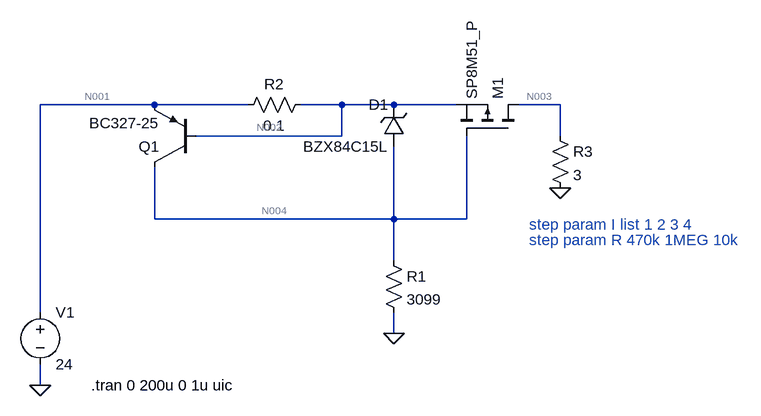
[diagram p0: schematic current_limiter.asc]
current_limiter.asc, the LTspice schematic file:
Version 4
SHEET 1 932 680
WIRE 16 112 -160 112
WIRE 160 112 16 112
WIRE 304 112 240 112
WIRE 384 112 304 112
WIRE 480 112 384 112
WIRE 640 112 576 112
WIRE 304 160 304 112
WIRE 304 160 80 160
WIRE 640 160 640 112
WIRE 16 288 16 208
WIRE 384 288 384 176
WIRE 384 288 16 288
WIRE 496 288 496 160
WIRE 496 288 384 288
WIRE 384 352 384 288
WIRE -160 432 -160 112
WIRE 384 464 384 432
WIRE -160 544 -160 512
FLAG 384 464 0
FLAG -160 544 0
FLAG 640 240 0
SYMBOL pnp 80 208 R180
SYMATTR InstName Q1
SYMATTR Value BC327-25
SYMBOL zener 400 176 R180
WINDOW 0 24 64 Left 2
WINDOW 3 24 0 Left 2
SYMATTR InstName D1
SYMATTR Value BZX84C15L
SYMATTR Description Diode
SYMATTR Type diode
SYMBOL res 368 336 R0
SYMATTR InstName R1
SYMATTR Value 3099
SYMBOL res 256 96 R90
WINDOW 0 0 56 VBottom 2
WINDOW 3 32 56 VTop 2
SYMATTR InstName R2
SYMATTR Value 0.1
SYMBOL pmos 576 160 M270
SYMATTR InstName M1
SYMATTR Value SP8M51_P
SYMBOL voltage -160 416 R0
SYMATTR InstName V1
SYMATTR Value 24
SYMBOL res 624 144 R0
SYMATTR InstName R3
SYMATTR Value 3
TEXT -82 544 Left 2 !.tran 0 200u 0 1u uic
TEXT 592 296 Left 2 ;step param I list 1 2 3 4
TEXT 592 320 Left 2 ;step param R 470k 1MEG 10k

The netlist it stands for:
* current_limiter.asc
Q1 N004 N002 N001 0 BC327-25
D1 N004 N002 BZX84C15L
R1 N004 0 3099
R2 N002 N001 0.1
M1 N003 N004 N002 N002 SP8M51_P
V1 N001 0 24
R3 N003 0 3
.model D D
.lib standard.dio
.model NPN NPN
.model PNP PNP
.lib standard.bjt
.model NMOS NMOS
.model PMOS PMOS
.lib standard.mos
.tran 0 200u 0 1u uic
* step param I list 1 2 3 4
* step param R 470k 1MEG 10k
.backanno
.end

* Results of the author's LTspice run, read from the files saved beside the schematic
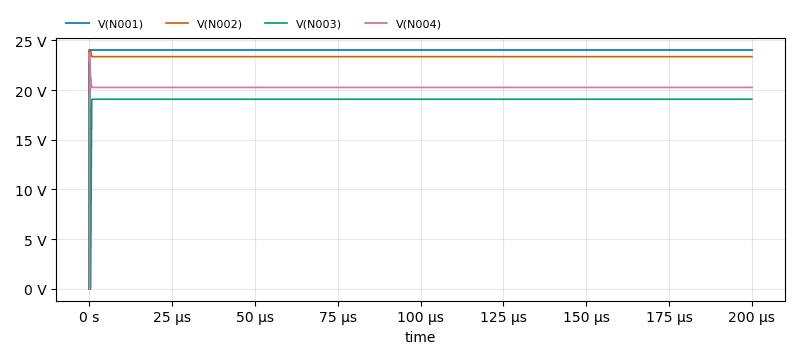
[diagram p1: Transient Analysis of current_limiter.asc, plotted from the saved traces]
* Transient Analysis, 1 run:
*   V(N001): min 0 V, max 24 V, average 24 V, rms 24 V, last 24 V
*   V(N002): min 0 V, max 24 V, average 23.37 V, rms 23.37 V, last 23.36 V
*   V(N003): min -543.9 µV, max 22.82 V, average 19.03 V, rms 19.05 V, last 19.08 V
*   V(N004): min 0 V, max 23.78 V, average 20.27 V, rms 20.27 V, last 20.27 V